# EasyEDA Pro project e_oct_dice_Dec_2022.eprj, schematic e_oct_dice_sch_v0_6
Create Date: 2022-12-15; Page Name: P1; Project Name: e_oct_dice_Dec_2022; Schematic Name: e_oct_dice_sch_v0_6; Update Date: 2023-02-17; Company: CC BY-SA 4.0 International; Drawed: RONG BAO; Page Size: A4; Part Number: P1; Reviewed: RONG BAO; Version: v0.6
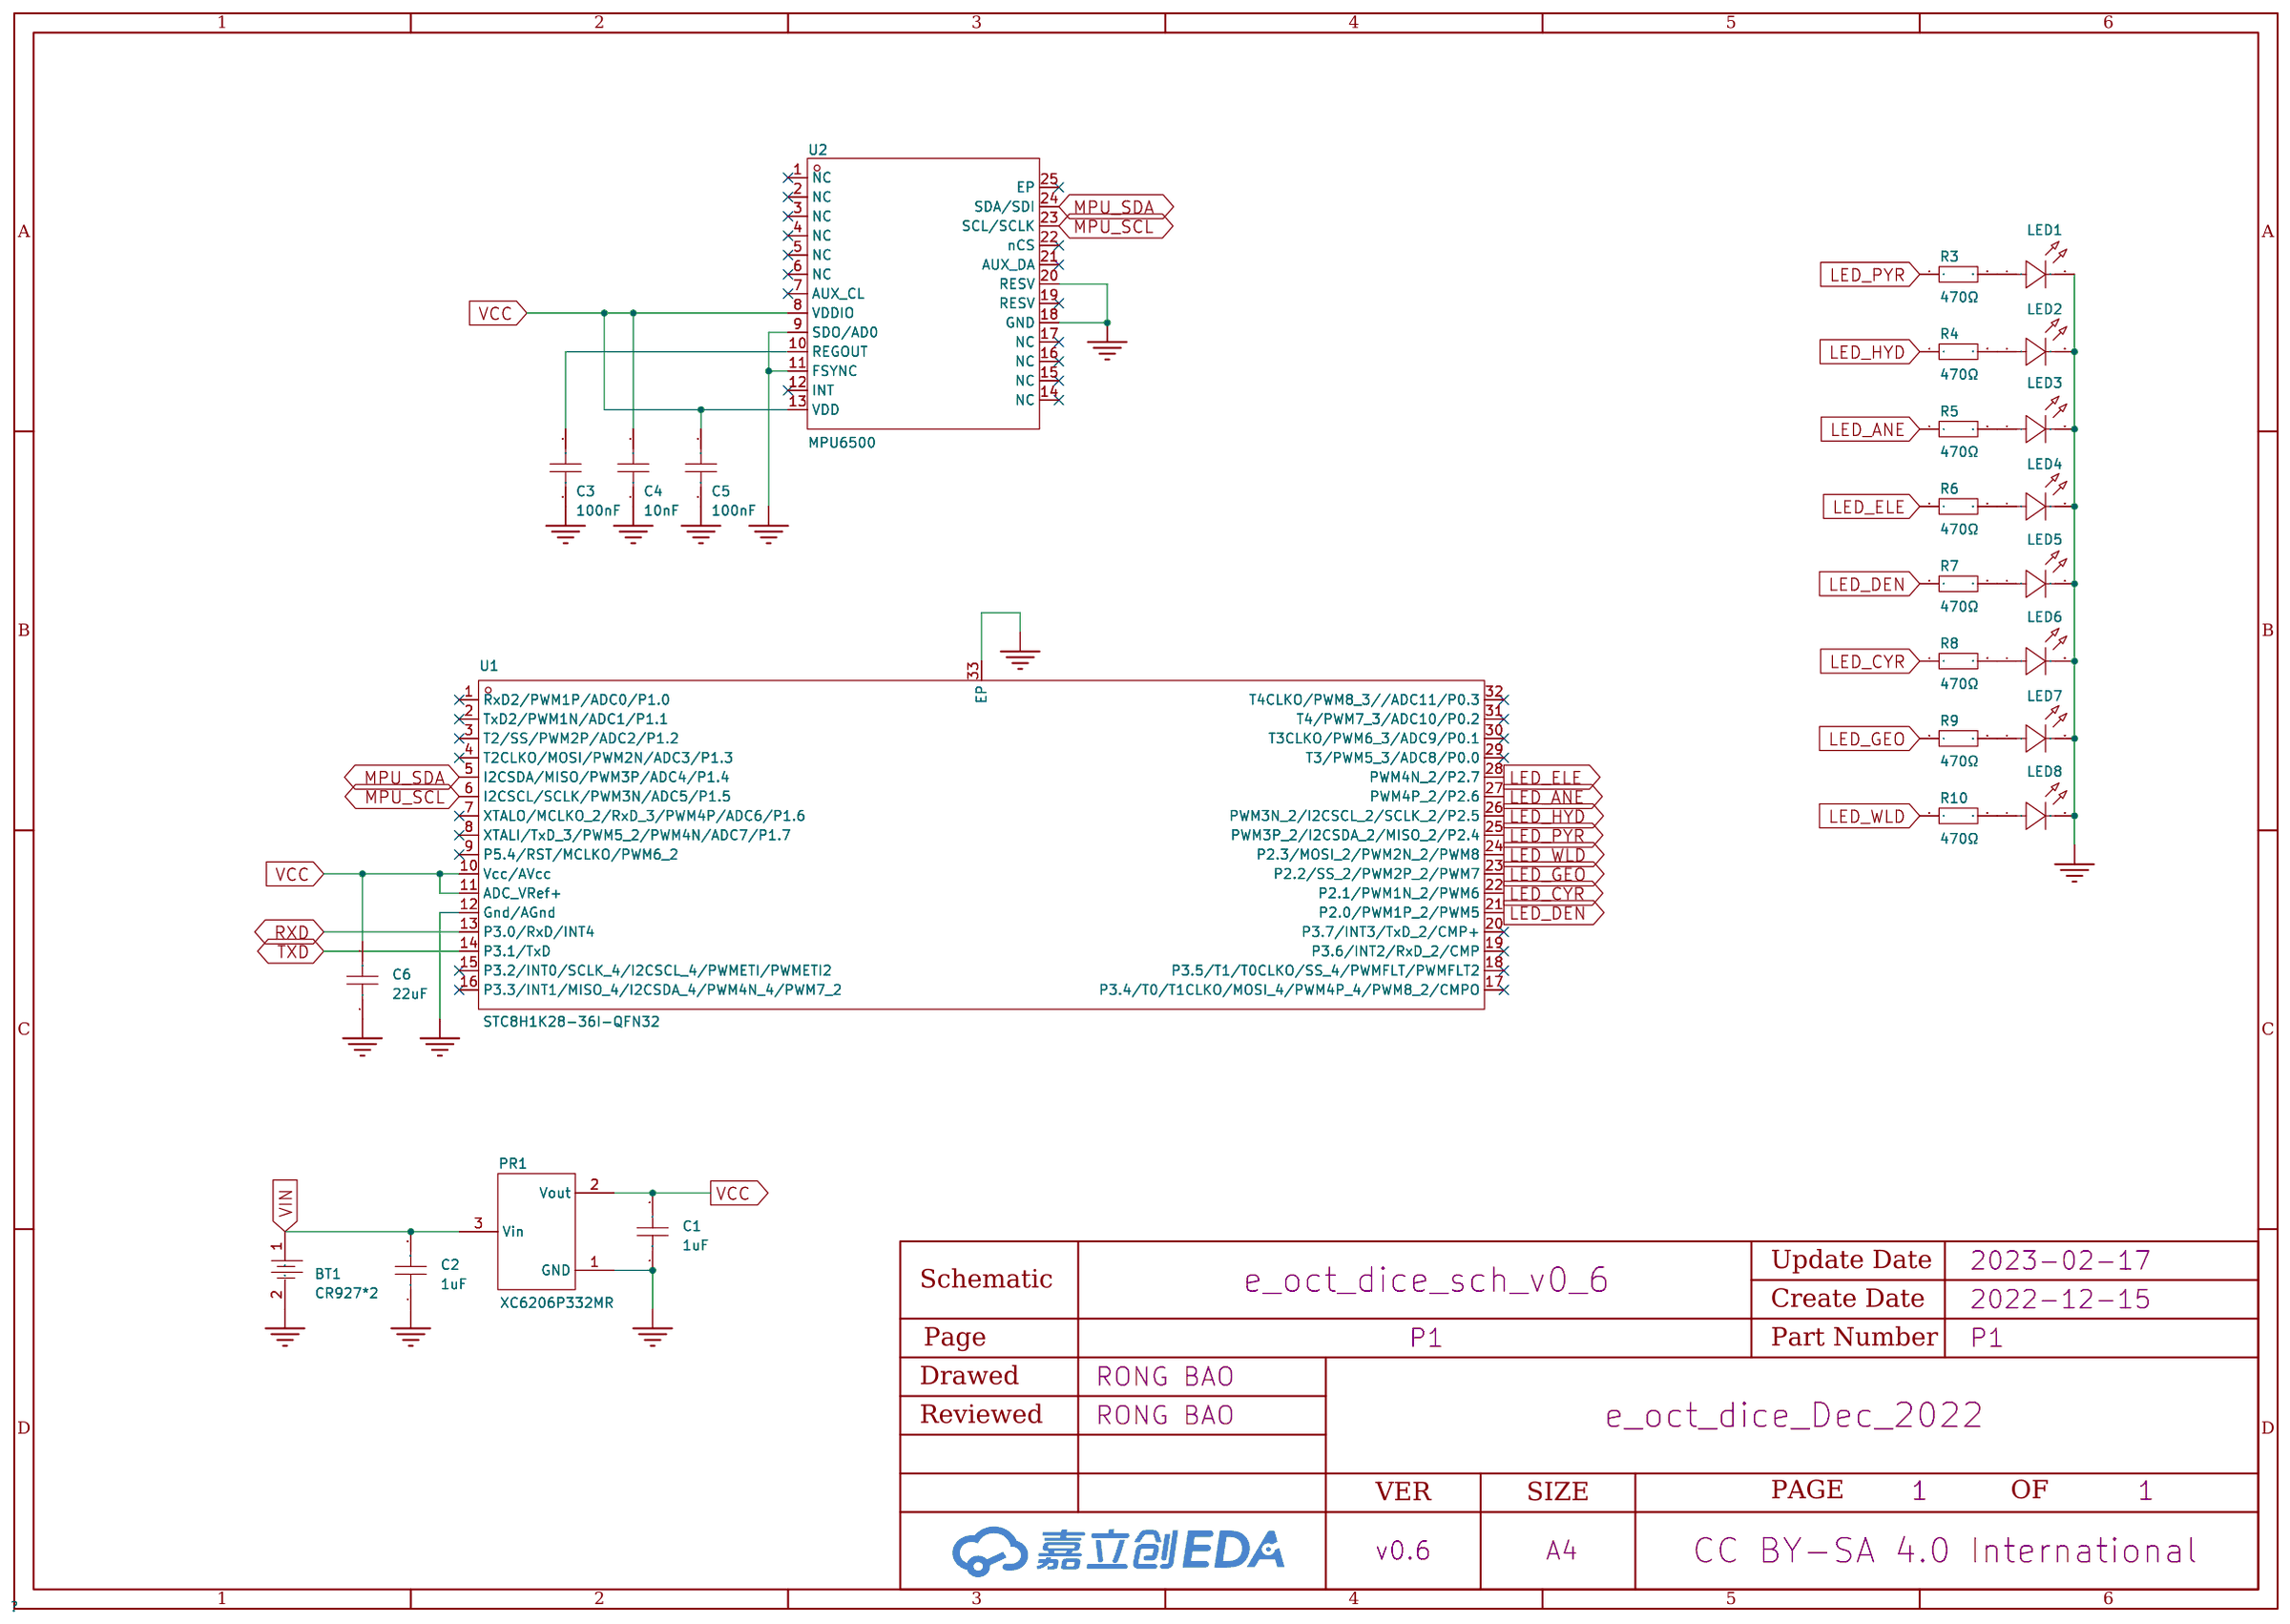
[diagram p3: schematic sheet]

## Parts
BT1  CR927*2  [BAT-TH_MY-927-01]
C1  1uF  [C0402]
C2  1uF  [C0402]
C3  100nF  [C0402_NEW]
C4  10nF  [C0402]
C5  100nF  [C0402_NEW]
C6  22uF  [C0603]
LED1  PYR  [LED-TH_BD3.8-P2.54-FD_WHITE]  (no BOM)
LED2  HYD  [LED-TH_BD3.8-P2.54-FD_WHITE]  (no BOM)
LED3  ANE  [LED-TH_BD3.8-P2.54-FD_WHITE]  (no BOM)
LED4  ELE  [LED-TH_BD3.8-P2.54-FD_WHITE]  (no BOM)
LED5  DEN  [LED-TH_BD3.8-P2.54-FD_WHITE]  (no BOM)
LED6  CYR  [LED-TH_BD3.8-P2.54-FD_WHITE]  (no BOM)
LED7  GEO  [LED-TH_BD3.8-P2.54-FD_WHITE]  (no BOM)
LED8  WLD  [LED-TH_BD3.8-P2.54-FD_WHITE]  (no BOM)
PR1  XC6206P332MR  [SOT-23-3_L2.9-W1.6-P1.90-LS2.8-BR]
R3  470Ω  [R0402]
R4  470Ω  [R0402]
R5  470Ω  [R0402]
R6  470Ω  [R0402]
R7  470Ω  [R0402]
R8  470Ω  [R0402]
R9  470Ω  [R0402]
R10  470Ω  [R0402]
U1  STC8H1K28-36I-QFN32  [QFN-32_L4.0-W4.0-P0.40-BL-EP2.8]
U2  MPU6500  [QFN-24_L3.0-W3.0-P0.40-BL-EP]

## Library data of the parts
BT1 = MY-927-01: 连接器类型:电池扣;适用电池规格:CR927;工作温度范围:-;; LCSC Part Name: 电池扣 适用电池:CR927; Supplier Part: C964850; Manufacturer: MYOUNG(美阳); Supplier Footprint: 插件; JLCPCB Part Class: Extended Part; Datasheet: https://atta.szlcsc.com/upload/public/pdf/source/20201218/C964850_48FDFDE1A9A12212C9EC07C1F9ECA79B.pdf; Supplier: LCSC; Connector Type: 电池扣; Battery Type: CR927
C1 C2 = CL05A105KA5NQNC: 容值:1uF;精度:±10%;额定电压:25V;材质(温度系数):X5R;; LCSC Part Name: 1uF ±10% 25V; Supplier Part: C52923; Manufacturer: SAMSUNG(三星); Supplier Footprint: 0402; JLCPCB Part Class: Basic Part; Datasheet: https://atta.szlcsc.com/upload/public/pdf/source/20160103/1457707735223.pdf; Supplier: LCSC; Tolerance: ±10%; Voltage Rated: 25V; Temperature Coefficient: X5R
C3 C5 = CL05B104KO5NNNC: 容值:100nF;精度:±10%;额定电压:16V;材质(温度系数):X7R;; LCSC Part Name: 100nF ±10% 16V; Supplier Part: C1525; Manufacturer: SAMSUNG(三星); Supplier Footprint: 0402; JLCPCB Part Class: Basic Part; Datasheet: https://atta.szlcsc.com/upload/public/pdf/source/20160103/1457707674891.pdf; Supplier: LCSC; Tolerance: ±10%; Voltage Rated: 16V; Temperature Coefficient: X7R
C4 = CL05B103KB5NNNC: 容值:10nF;精度:±10%;额定电压:50V;材质(温度系数):X7R;; LCSC Part Name: 10nF ±10% 50V; Supplier Part: C15195; Manufacturer: SAMSUNG(三星); Supplier Footprint: 0402; JLCPCB Part Class: Basic Part; Datasheet: https://atta.szlcsc.com/upload/public/pdf/source/20160103/1457707674468.pdf; Supplier: LCSC; Tolerance: ±10%; Voltage Rated: 50V; Temperature Coefficient: X7R
C6 = CL10A226MQ8NRNC: 容值:22uF;精度:±20%;额定电压:6.3V;材质(温度系数):X5R;; LCSC Part Name: 22uF ±20% 6.3V; Supplier Part: C59461; Manufacturer: SAMSUNG(三星); Supplier Footprint: 0603; JLCPCB Part Class: Basic Part; Datasheet: https://atta.szlcsc.com/upload/public/pdf/source/20160103/1457707740762.pdf; Supplier: LCSC; Tolerance: ±20%; Voltage Rated: 6.3V; Temperature Coefficient: X5R
LED1 = XL-302UWC: 发光颜色:白灯;透镜颜色:无色透明;色温:6000K~6500K;测试电流:20mA;功率:80mW;发光角度:50°;安装方式:-;工作温度:-25℃~+85℃;; LCSC Part Name: 白灯 6000K~6500K; Supplier Part: C2895458; Manufacturer: XINGLIGHT(成兴光); Supplier Footprint: 插件,D=3mm; JLCPCB Part Class: Extended Part; Datasheet: https://atta.szlcsc.com/upload/public/pdf/source/20220816/95DCBD942C61C750E3165A46E2F97F4A.pdf; Supplier: LCSC; Emitted Color: 白灯; Lens Color: 无色透明; Color Temperature: 6000K~6500K; Forward Current: 20mA; Power Dissipation: 80mW; Viewing Angle: 50°; Operating Temperature: -25℃~+85℃; Lamp Holder Type: 3mm圆形灯头; Dominant Wavelength: 624nm; Peak Wavelength: 632nm
LED2 LED4-LED8 = XL-302UWC: 发光颜色:白灯;透镜颜色:无色透明;色温:6000K~6500K;测试电流:20mA;功率:80mW;发光角度:50°;安装方式:-;工作温度:-25℃~+85℃;; LCSC Part Name: 白灯 6000K~6500K; Supplier Part: C2895458; Manufacturer: XINGLIGHT(成兴光); Supplier Footprint: 插件,D=3mm; JLCPCB Part Class: Extended Part; Datasheet: https://atta.szlcsc.com/upload/public/pdf/source/20220816/95DCBD942C61C750E3165A46E2F97F4A.pdf; Supplier: LCSC; Emitted Color: 白灯; Lens Color: 无色透明; Color Temperature: 6000K~6500K; Forward Current: 20mA; Power Dissipation: 80mW; Viewing Angle: 50°; Operating Temperature: -25℃~+85℃; Lamp Holder Type: 3mm圆形灯头
LED3 = XL-302UWC: 发光颜色:白灯;透镜颜色:无色透明;色温:6000K~6500K;测试电流:20mA;功率:80mW;发光角度:50°;安装方式:-;工作温度:-25℃~+85℃;; LCSC Part Name: 白灯 6000K~6500K; Supplier Part: C2895458; Manufacturer: XINGLIGHT(成兴光); Supplier Footprint: 插件,D=3mm; JLCPCB Part Class: Extended Part; Datasheet: https://atta.szlcsc.com/upload/public/pdf/source/20220816/95DCBD942C61C750E3165A46E2F97F4A.pdf; Supplier: LCSC; Emitted Color: 白灯; Lens Color: 无色透明; Color Temperature: 6000K~6500K; Forward Current: 20mA; Power Dissipation: 80mW; Viewing Angle: 50°; Operating Temperature: -25℃~+85℃; Lamp Holder Type: 3mm圆形灯头; Dominant Wavelength: 530nm; Peak Wavelength: 525nm
PR1 = XC6206P332MR_C5446: 输出类型:固定;输出极性:正;输出通道数:1;最大输入电压:6V;输出电压:3.3V;压差:680mV@(100mA);输出电流:200mA;电源纹波抑制比(PSRR):-;; LCSC Part Name: 正 Vin=6V Vout=3.3V 200mA; Supplier Part: C5446; Manufacturer: TOREX(特瑞仕); Supplier Footprint: SOT-23-3L; JLCPCB Part Class: Basic Part; Datasheet: https://atta.szlcsc.com/upload/public/pdf/source/20130801/1457706628791.pdf; Supplier: LCSC; Output Type: 固定; Output Polarity: 正; Number of Outputs: 1; Maximum Input Voltage: 6V; Output Voltage: 3.3V; Dropout Voltage: 680mV@(100mA); Output Current: 200mA
R3-R10 = 0402WGF4700TCE: LCSC Part Name: 470Ω(4700) ±1% 编带; Supplier Part: C25117; Manufacturer: UNI-ROYAL(厚声); Supplier Footprint: 0402; JLCPCB Part Class: Basic Part; Datasheet: https://atta.szlcsc.com/upload/public/pdf/source/20170920/C25117_1505901219153982748.pdf; Supplier: LCSC
U1 = STC8H1K28-36I-QFN32: Supplier Part: C915680; Manufacturer: STC(宏晶); Supplier Footprint: QFN-32-EP(4x4); JLCPCB Part Class: Extended Part; Datasheet: https://atta.szlcsc.com/upload/public/pdf/source/20220208/F43AF8AFB82417D1483669F3A0ABE01D.pdf; Supplier: LCSC
U2 = MPU6500: Accelerometer, Gyroscope, 3 Axis Sensor I2C, SPI Output; Supplier Part: C50278; Manufacturer: TDK InvenSense(应美盛); Supplier Footprint: QFN-24; JLCPCB Part Class: Extended Part; Datasheet: https://atta.szlcsc.com/upload/public/pdf/source/20170505/1493957890595.pdf; Supplier: LCSC

## Nets
GND: BT1.2 C1.1 C2.1 C3.2 C4.2 C5.2 C6.1 LED1.2(A) LED2.2(A) LED3.2(A) LED4.2(A) LED5.2(A) LED6.2(A) LED7.2(A) LED8.2(A) PR1.1(GND) U1.12(Gnd/AGnd) U1.33(EP) U2.9(SDO/AD0) U2.11(FSYNC) U2.18(GND) U2.20(RESV)
VCC: C1.2 C4.1 C5.1 C6.2 PR1.2(Vout) U1.10(Vcc/AVcc) U1.11(ADC_VRef+) U2.8(VDDIO) U2.13(VDD)
VIN: BT1.1 C2.2 PR1.3(Vin)
LED_ANE: R5.1 U1.27(PWM4P_2/P2.6)
LED_CYR: R8.1 U1.22(P2.1/PWM1N_2/PWM6)
LED_DEN: R7.1 U1.21(P2.0/PWM1P_2/PWM5)
LED_ELE: R6.1 U1.28(PWM4N_2/P2.7)
LED_GEO: R9.1 U1.23(P2.2/SS_2/PWM2P_2/PWM7)
LED_HYD: R4.1 U1.26(PWM3N_2/I2CSCL_2/SCLK_2/P2.5)
LED_PYR: R3.1 U1.25(PWM3P_2/I2CSDA_2/MISO_2/P2.4)
LED_WLD: R10.1 U1.24(P2.3/MOSI_2/PWM2N_2/PWM8)
MPU_SCL: U1.6(I2CSCL/SCLK/PWM3N/ADC5/P1.5) U2.23(SCL/SCLK)
MPU_SDA: U1.5(I2CSDA/MISO/PWM3P/ADC4/P1.4) U2.24(SDA/SDI)
RXD: U1.13(P3.0/RxD/INT4)
TXD: U1.14(P3.1/TxD)
$1N2923: C3.1 U2.10(REGOUT)
$1N36634: LED1.1(K) R3.2
$1N36786: LED2.1(K) R4.2
$1N36892: LED3.1(K) R5.2
$1N36980: LED4.1(K) R6.2
$1N37068: LED5.1(K) R7.2
$1N37156: LED6.1(K) R8.2
$1N37244: LED7.1(K) R9.2
$1N37332: LED8.1(K) R10.2

Not connected (* = marked no-connect by the designer): U1 1(RxD2/PWM1P/ADC0/P1.0)* 2(TxD2/PWM1N/ADC1/P1.1)* 3(T2/SS/PWM2P/ADC2/P1.2)* 4(T2CLKO/MOSI/PWM2N/ADC3/P1.3)* 7(XTALO/MCLKO_2/RxD_3/PWM4P/ADC6/P1.6)* 8(XTALI/TxD_3/PWM5_2/PWM4N/ADC7/P1.7)* 9(P5.4/RST/MCLKO/PWM6_2)* 15(P3.2/INT0/SCLK_4/I2CSCL_4/PWMETI/PWMETI2)* 16(P3.3/INT1/MISO_4/I2CSDA_4/PWM4N_4/PWM7_2)* 17(P3.4/T0/T1CLKO/MOSI_4/PWM4P_4/PWM8_2/CMPO)* 18(P3.5/T1/T0CLKO/SS_4/PWMFLT/PWMFLT2)* 19(P3.6/INT2/RxD_2/CMP)* 20(P3.7/INT3/TxD_2/CMP+)* 29(T3/PWM5_3/ADC8/P0.0)* 30(T3CLKO/PWM6_3/ADC9/P0.1)* 31(T4/PWM7_3/ADC10/P0.2)* 32(T4CLKO/PWM8_3//ADC11/P0.3)*; U2 1(NC)* 2(NC)* 3(NC)* 4(NC)* 5(NC)* 6(NC)* 7(AUX_CL)* 12(INT)* 14(NC)* 15(NC)* 16(NC)* 17(NC)* 19(RESV)* 21(AUX_DA)* 22(nCS)* 25(EP)*
